# EAGLE design guest room controller (EAGLE 7.2.0)
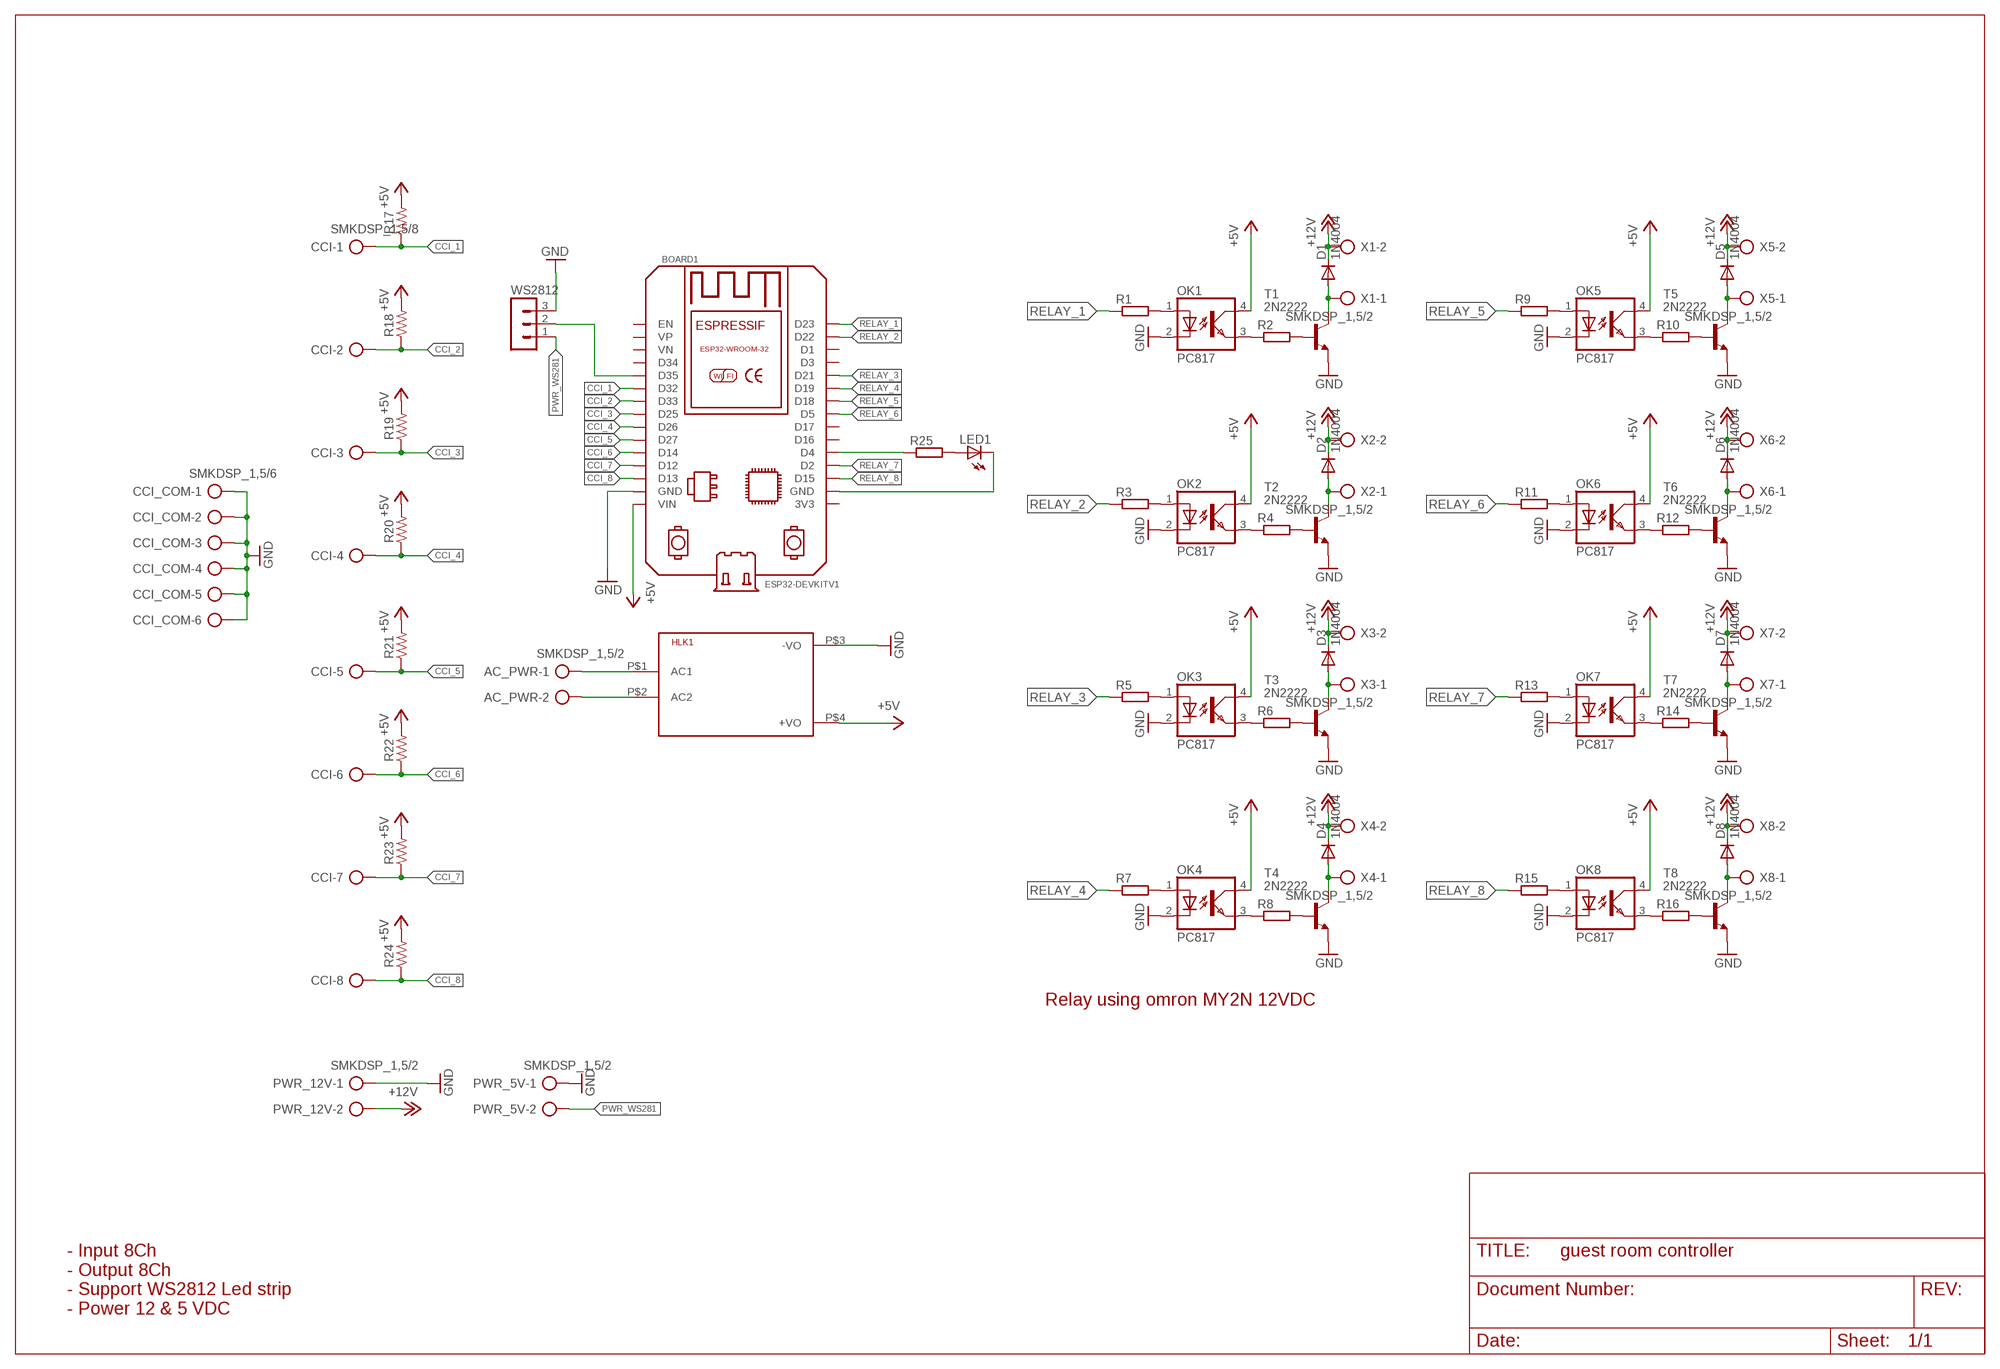
[diagram p0: schematic, sheet 1]

## Parts
AC_PWR  SMKDSP_1,5/2  [SMKDSP_1,5/2]
BOARD1  ESP32DEVKITV1  [ESP32-DEVKITV1]
CCI  SMKDSP_1,5/8  [SMKDSP_1,5/8]
CCI_COM  SMKDSP_1,5/6  [SMKDSP_1,5/6]
D1  1N4004  [DO41-10]
D2  1N4004  [DO41-10]
D3  1N4004  [DO41-10]
D4  1N4004  [DO41-10]
D5  1N4004  [DO41-10]
D6  1N4004  [DO41-10]
D7  1N4004  [DO41-10]
D8  1N4004  [DO41-10]
HLK1  HLK-PM013W  [HLK-PM01]
LED1  LED3MM  [LED3MM]
OK1  PC817  [DIL04]
OK2  PC817  [DIL04]
OK3  PC817  [DIL04]
OK4  PC817  [DIL04]
OK5  PC817  [DIL04]
OK6  PC817  [DIL04]
OK7  PC817  [DIL04]
OK8  PC817  [DIL04]
PWR_5V  SMKDSP_1,5/2  [SMKDSP_1,5/2]
PWR_12V  SMKDSP_1,5/2  [SMKDSP_1,5/2]
R1  R-EU_0207/10  [0207/10]
R2  R-EU_0207/10  [0207/10]
R3  R-EU_0207/10  [0207/10]
R4  R-EU_0207/10  [0207/10]
R5  R-EU_0207/10  [0207/10]
R6  R-EU_0207/10  [0207/10]
R7  R-EU_0207/10  [0207/10]
R8  R-EU_0207/10  [0207/10]
R9  R-EU_0207/10  [0207/10]
R10  R-EU_0207/10  [0207/10]
R11  R-EU_0207/10  [0207/10]
R12  R-EU_0207/10  [0207/10]
R13  R-EU_0207/10  [0207/10]
R14  R-EU_0207/10  [0207/10]
R15  R-EU_0207/10  [0207/10]
R16  R-EU_0207/10  [0207/10]
R17  R_1206  [R1206]
R18  R_1206  [R1206]
R19  R_1206  [R1206]
R20  R_1206  [R1206]
R21  R_1206  [R1206]
R22  R_1206  [R1206]
R23  R_1206  [R1206]
R24  R_1206  [R1206]
R25  R-EU_0207/10  [0207/10]
T1  2N2222  [TO18]
T2  2N2222  [TO18]
T3  2N2222  [TO18]
T4  2N2222  [TO18]
T5  2N2222  [TO18]
T6  2N2222  [TO18]
T7  2N2222  [TO18]
T8  2N2222  [TO18]
WS2812  MA03-1  [MA03-1]
X1  SMKDSP_1,5/2  [SMKDSP_1,5/2]
X2  SMKDSP_1,5/2  [SMKDSP_1,5/2]
X3  SMKDSP_1,5/2  [SMKDSP_1,5/2]
X4  SMKDSP_1,5/2  [SMKDSP_1,5/2]
X5  SMKDSP_1,5/2  [SMKDSP_1,5/2]
X6  SMKDSP_1,5/2  [SMKDSP_1,5/2]
X7  SMKDSP_1,5/2  [SMKDSP_1,5/2]
X8  SMKDSP_1,5/2  [SMKDSP_1,5/2]

## Nets
+5V: BOARD1.VIN HLK1.P$4(+VO) OK1.4(COL) OK2.4(COL) OK3.4(COL) OK4.4(COL) OK5.4(COL) OK6.4(COL) OK7.4(COL) OK8.4(COL) R17.2 R18.2 R19.2 R20.2 R21.2 R22.2 R23.2 R24.2
+12V: D1.C D2.C D3.C D4.C D5.C D6.C D7.C D8.C PWR_12V.2 X1.2 X2.2 X3.2 X4.2 X5.2 X6.2 X7.2 X8.2
CCI_1: BOARD1.D32 CCI.1 R17.1
CCI_2: BOARD1.D33 CCI.2 R18.1
CCI_3: BOARD1.D25 CCI.3 R19.1
CCI_4: BOARD1.D26 CCI.4 R20.1
CCI_5: BOARD1.D27 CCI.5 R21.1
CCI_6: BOARD1.D14 CCI.6 R22.1
CCI_7: BOARD1.D12 CCI.7 R23.1
CCI_8: BOARD1.D13 CCI.8 R24.1
GND: BOARD1.GND CCI_COM.1 CCI_COM.2 CCI_COM.3 CCI_COM.4 CCI_COM.5 CCI_COM.6 HLK1.P$3(-VO) OK1.2(C) OK2.2(C) OK3.2(C) OK4.2(C) OK5.2(C) OK6.2(C) OK7.2(C) OK8.2(C) PWR_5V.1 PWR_12V.1 T1.1(E) T2.1(E) T3.1(E) T4.1(E) T5.1(E) T6.1(E) T7.1(E) T8.1(E) WS2812.3
N$1: OK1.3(EMIT) R2.1
N$2: R2.2 T1.2(B)
N$3: D1.A T1.3(C) X1.1
N$4: OK2.3(EMIT) R4.1
N$5: R4.2 T2.2(B)
N$6: D2.A T2.3(C) X2.1
N$7: OK3.3(EMIT) R6.1
N$8: R6.2 T3.2(B)
N$9: D3.A T3.3(C) X3.1
N$10: OK4.3(EMIT) R8.1
N$11: R8.2 T4.2(B)
N$12: D4.A T4.3(C) X4.1
N$13: OK5.3(EMIT) R10.1
N$14: R10.2 T5.2(B)
N$15: D5.A T5.3(C) X5.1
N$16: OK6.3(EMIT) R12.1
N$17: R12.2 T6.2(B)
N$18: D6.A T6.3(C) X6.1
N$19: OK7.3(EMIT) R14.1
N$20: R14.2 T7.2(B)
N$21: D7.A T7.3(C) X7.1
N$22: OK8.3(EMIT) R16.1
N$23: R16.2 T8.2(B)
N$24: D8.A T8.3(C) X8.1
N$25: AC_PWR.1 HLK1.P$1(AC1)
N$26: OK1.1(A) R1.2
N$27: OK2.1(A) R3.2
N$28: OK3.1(A) R5.2
N$29: OK4.1(A) R7.2
N$30: OK5.1(A) R9.2
N$31: OK6.1(A) R11.2
N$32: OK7.1(A) R13.2
N$33: OK8.1(A) R15.2
N$35: BOARD1.D4 R25.1
N$36: LED1.A R25.2
N$37: BOARD1.GND@1(GND) LED1.K(C)
N$38: BOARD1.D35 WS2812.2
N$39: AC_PWR.2 HLK1.P$2(AC2)
PWR_WS281: PWR_5V.2 WS2812.1
RELAY_1: BOARD1.D23 R1.1
RELAY_2: BOARD1.D22 R3.1
RELAY_3: BOARD1.D21 R5.1
RELAY_4: BOARD1.D19 R7.1
RELAY_5: BOARD1.D18 R9.1
RELAY_6: BOARD1.D5 R11.1
RELAY_7: BOARD1.D2 R13.1
RELAY_8: BOARD1.D15 R15.1
Unconnected: BOARD1.3V3 BOARD1.D1 BOARD1.D3 BOARD1.D16 BOARD1.D17 BOARD1.D34 BOARD1.EN BOARD1.VN BOARD1.VP

## Notes on the sheet
- Relay using omron MY2N 12VDC
- - Input 8Ch
  - Output 8Ch
  - Support WS2812 Led strip
  - Power 12 & 5 VDC

## Library data of the parts
AC_PWR PWR_5V PWR_12V X1-X8 = con-phoenix-smkdsp:SMKDSP_1,5/2: Printklemme, Nennstrom: 17,5 A, Bemessungsspannung: 250 V, Raster: 5,0 mm Source: http://eshop.phoenixcontact.de .. 1733415.pdf; MF: FARNELL; MPN: 1733570; OC_FARNELL: 3041244; OC_NEWARK: 69C8588
BOARD1 = ESP32-DEVKITV1:ESP32DEVKITV1: https://github.com/shridattdudhat
CCI = con-phoenix-smkdsp:SMKDSP_1,5/8: Printklemme, Nennstrom: 17,5 A, Bemessungsspannung: 250 V, Raster: 5,0 mm Source: http://eshop.phoenixcontact.de .. 1733415.pdf; MF: FARNELL; MPN: 1733635; OC_FARNELL: 3041281; OC_NEWARK: 71C4133
CCI_COM = con-phoenix-smkdsp:SMKDSP_1,5/6: Printklemme, Nennstrom: 17,5 A, Bemessungsspannung: 250 V, Raster: 5,0 mm Source: http://eshop.phoenixcontact.de .. 1733415.pdf; MF: FARNELL; MPN: 1733619; OC_FARNELL: 3041270; OC_NEWARK: 71C4132
D1-D8 = diode:1N4004: DIODE general purpose rectifier, 1 A
HLK1 = HLK-PM01:HLK-PM01: Hi-Link Power Supply HLK-PM01 3W Author: Ahmed Said <https://github.com/AhmedSaid/EAGLELibraries>
LED1 = led:LED: LED OSRAM: - CHIPLED LG R971, LG N971, LY N971, LG Q971, LY Q971, LO R971, LY R971 LH N974, LH R974 LS Q976, LO Q976, LY Q976 LO Q996 - Hyper CHIPLED LW Q18S LB Q993, LB Q99A, LB R99A - SideLED LS A670, LO A670, LY A670, LG A670, LP A670 LB A673, LV A673, LT A673, LW A673 LH A674 LY A675 LS A676, LA A676, LO A676, LY A676, LW A676 LS A679, LY A679, LG A679 - Hyper Micro SIDELED® LS Y876, LA Y876, LO Y876, LY Y876 LT Y87S - SmartLED LW L88C, LW L88S LB L89C, LB L89S, LG L890 LS L89K, LO L89K, LY L89K LS L896, LA L896, LO L896, LY L896 - TOPLED LS T670, LO T670, LY T670, LG T670, LP T670 LSG T670, LSP T670, LSY T670, LOP T670, LYG T670 LG T671, LOG T671, LSG T671 LB T673, LV T673, LT T673, LW T673 LH T674 LS T676, LA T676, LO T676, LY T676, LB T676, LH T676, LSB T676, LW T676 LB T67C, LV T67C, LT T67C, LS T67K, LO T67K, LY T67K, LW E67C LS E67B, LA E67B, LO E67B, LY E67B, LB E67C, LV E67C, LT E67C LW T67C LS T679, LY T679, LG T679 LS T770, LO T770, LY T770, LG T770, LP T770 LB T773, LV T773, LT T773, LW T773 LH T774 LS E675, LA E675, LY E675, LS T675 LS T776, LA T776, LO T776, LY T776, LB T776 LHGB T686 LT T68C, LB T68C - Hyper Mini TOPLED® LB M676 - Mini TOPLED Santana® LG M470 LS M47K, LO M47K, LY M47K Source: http://www.osram.convergy.de LUXEON: - LUMILED® LXK2-PW12-R00, LXK2-PW12-S00, LXK2-PW14-U00, LXK2-PW14-V00 LXK2-PM12-R00, LXK2-PM12-S00, LXK2-PM14-U00 LXK2-PE12-Q00, LXK2-PE12-R00, LXK2-PE12-S00, LXK2-PE14-T00, LXK2-PE14-U00 LXK2-PB12-K00, LXK2-PB12-L00, LXK2-PB12-M00, LXK2-PB14-N00, LXK2-PB14-P00, LXK2-PB14-Q00 LXK2-PR12-L00, LXK2-PR12-M00, LXK2-PR14-Q00, LXK2-PR14-R00 LXK2-PD12-Q00, LXK2-PD12-R00, LXK2-PD12-S00 LXK2-PH12-R00, LXK2-PH12-S00 LXK2-PL12-P00, LXK2-PL12-Q00, LXK2-PL12-R00 Source: www.luxeon.com KINGBRIGHT: KA-3528ASYC Source: www.kingbright.com
OK1-OK8 = optocoupler:PC817: SHARP OPTO COUPLER; MPN: PC817X4J000F; OC_FARNELL: 9707727; OC_NEWARK: 97K7059
R1-R16 R25 = resistor:R-EU_: RESISTOR, European symbol
R17-R24 = rc-master-smd:R_: RESISTOR
T1-T8 = transistor:2N2222: NPN TRANSISTOR
WS2812 = con-lstb:MA03-1: PIN HEADER; OC_FARNELL: unknown; OC_NEWARK: unknown

## Board
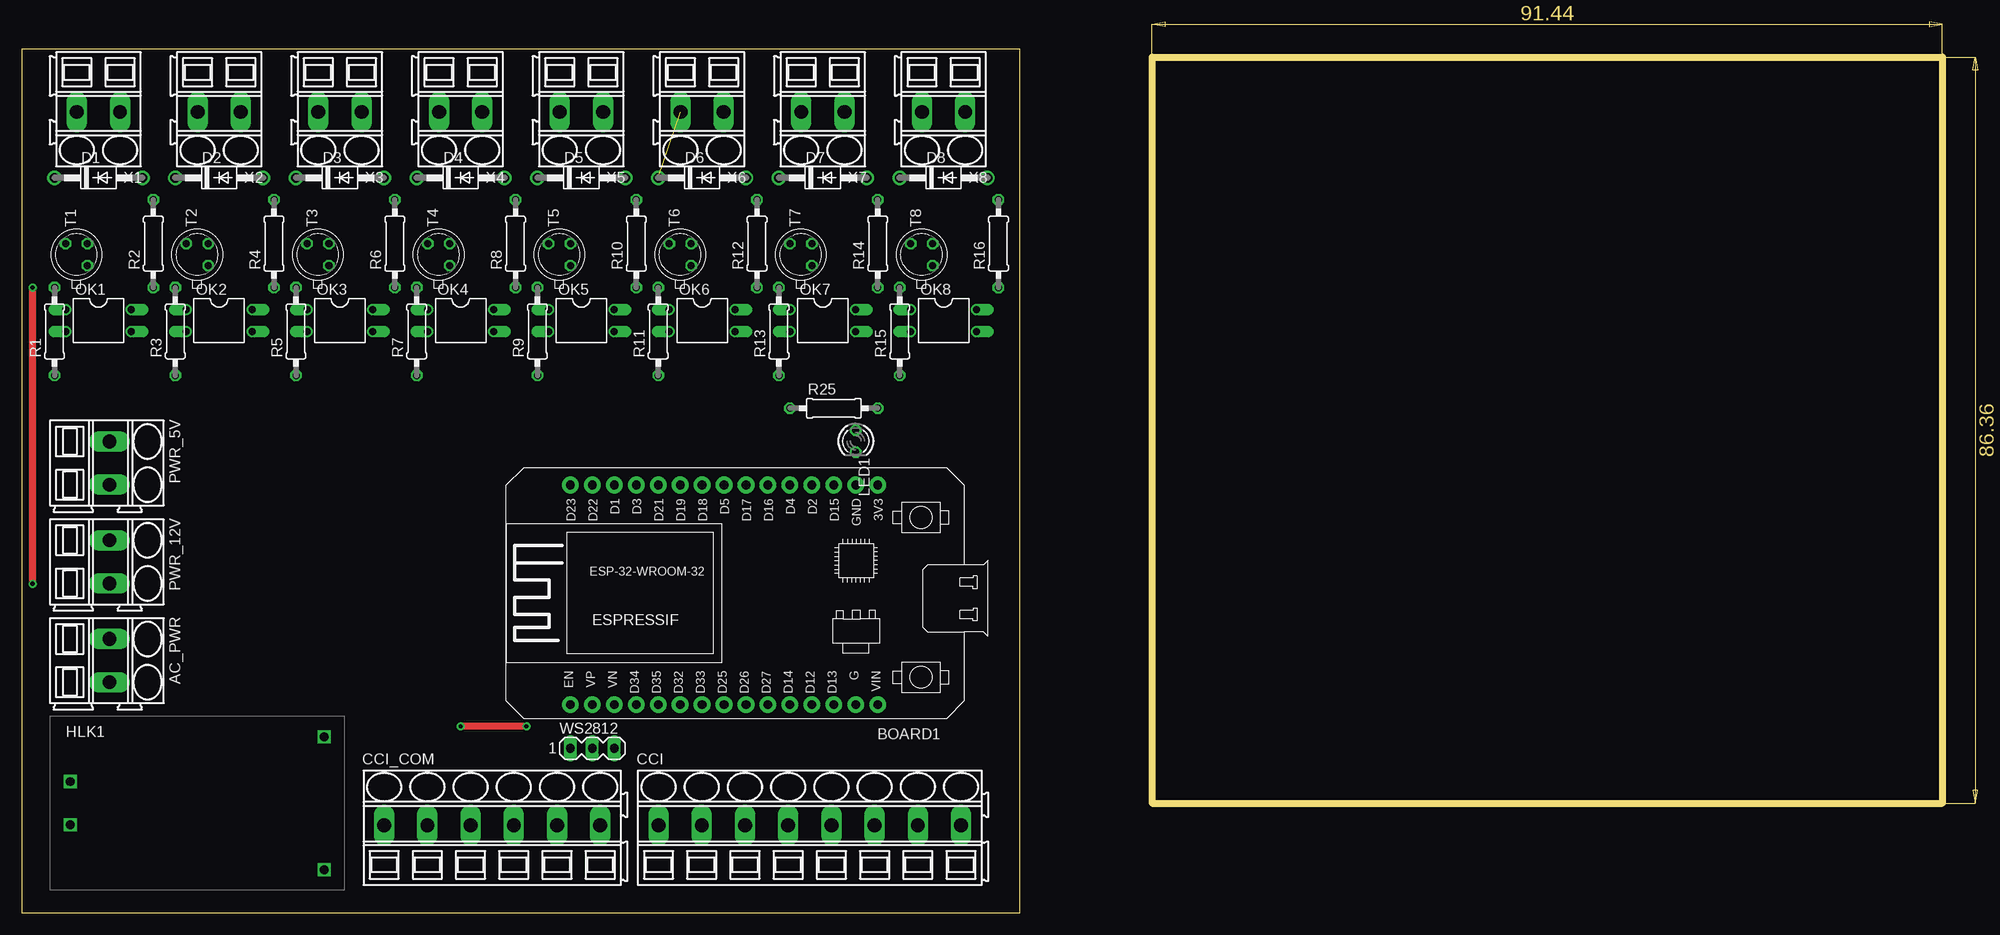
[diagram p1: board, top side]
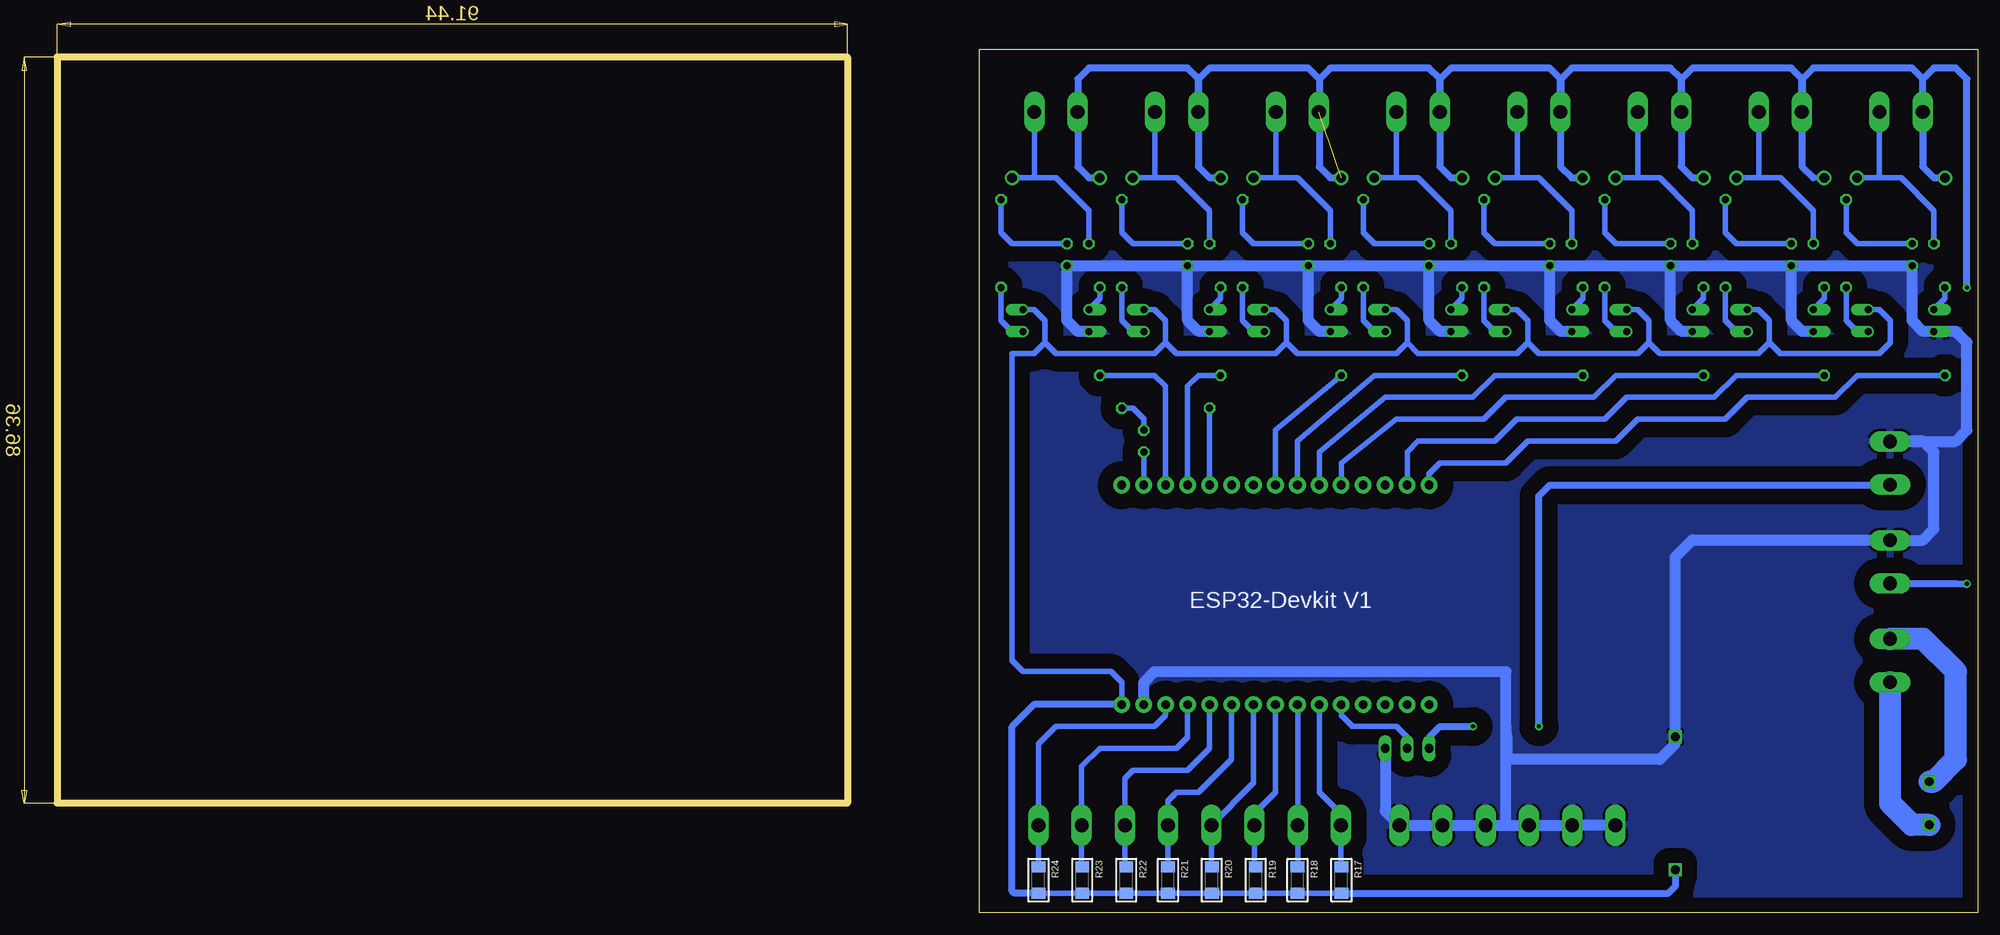
[diagram p2: board, bottom side, seen from below]

Size 222.25 x 100 mm. Coordinates in mm from the lower left corner, seen from the top.
Outline: 0,0 115.55,0 115.55,100 0,100 0,0
Outline: 130.81,99.06 222.25,99.06 222.25,12.7 130.81,12.7 130.81,99.06
Copper layers (1*16): Top 0.035mm / dielectric 1.5mm / Bottom 0.035mm
Design rules "default": minimum track width 10mil, minimum drill 24mil, track to track 8mil, track to pad 8mil, pad to pad 8mil, via to via 8mil, smd to smd 8mil, copper to edge 40mil, drill to drill 8mil, minimum pad ring 10mil, minimum via ring 8mil, stop-mask expansion 4mil, vias tented up to drill 0mil, thermal gap 10mil

### Footprints (pad centres in the part's own frame; a part is rotated, then mirrored left to right if it is on the bottom)
SMKDSP_1,5/2 = drill 1.6 pad 1.8 long: 1 -2.5,0; 2 2.5,0
ESP32-DEVKITV1 = drill 1 pad 1.93: 3V3 0,0; D1 30.48,0; D2 7.62,0; D3 27.94,0; D4 10.16,0; D5 17.78,0; D12 7.62,25.4; D13 5.08,25.4; D14 10.16,25.4; D15 5.08,0; D16 12.7,0; D17 15.24,0; D18 20.32,0; D19 22.86,0; D21 25.4,0; D22 33.02,0; D23 35.56,0; D25 17.78,25.4; D26 15.24,25.4; D27 12.7,25.4; D32 22.86,25.4; D33 20.32,25.4; D34 27.94,25.4; D35 25.4,25.4; EN 35.56,25.4; GND 2.54,25.4; GND@1 2.54,0; VIN 0,25.4; VN 30.48,25.4; VP 33.02,25.4
SMKDSP_1,5/8 = drill 1.6 pad 1.8 long: 1 -2.5,0; 2 2.5,0; 3 7.5,0; 4 12.5,0; 5 17.5,0; 6 22.5,0; 7 27.5,0; 8 32.5,0
SMKDSP_1,5/6 = drill 1.6 pad 1.8 long: 1 -2.5,0; 2 2.5,0; 3 7.5,0; 4 12.5,0; 5 17.5,0; 6 22.5,0
DO41-10 = drill 1.118: A 5.08,0; C -5.08,0
HLK-PM01 = drill 1.016 square: P$1 -14.7,2.5; P$2 -14.7,-2.5; P$3 14.7,7.7; P$4 14.7,-7.7
LED3MM = drill 0.813 octagon: A -1.27,0; K 1.27,0
DIL04 = drill 0.813 offset: 1 -1.27,-3.81; 2 1.27,-3.81; 3 1.27,3.81; 4 -1.27,3.81
0207/10 = drill 0.813 octagon: 1 -5.08,0; 2 5.08,0
R1206 = smd 1.3 x 1.6: 1 -1.524,0; 2 1.524,0
TO18 = drill 0.813 octagon: 1 -1.27,-1.27; 2 1.27,-1.27; 3 1.27,1.27
MA03-1 = drill 1.016 long: 1 -2.54,0; 2 0,0; 3 2.54,0

### Placement (x,y rotation side)
AC_PWR  10.16,29.21 270 top
BOARD1  99.06,49.53 180 top
CCI  76.2,10.16 0 top
CCI_COM  44.45,10.16 0 top
D1  8.89,85.09 0 top
D2  22.86,85.09 0 top
D3  36.83,85.09 0 top
D4  50.8,85.09 0 top
D5  64.77,85.09 0 top
D6  78.74,85.09 0 top
D7  92.71,85.09 0 top
D8  106.68,85.09 0 top
HLK1  20.32,12.7 0 top
LED1  96.52,54.61 270 top
OK1  8.89,68.58 270 top
OK2  22.86,68.58 270 top
OK3  36.83,68.58 270 top
OK4  50.8,68.58 270 top
OK5  64.77,68.58 270 top
OK6  78.74,68.58 270 top
OK7  92.71,68.58 270 top
OK8  106.68,68.58 270 top
PWR_5V  10.16,52.07 270 top
PWR_12V  10.16,40.64 270 top
R1  3.81,67.31 90 top
R2  15.24,77.47 90 top
R3  17.78,67.31 90 top
R4  29.21,77.47 90 top
R5  31.75,67.31 90 top
R6  43.18,77.47 90 top
R7  45.72,67.31 90 top
R8  57.15,77.47 90 top
R9  59.69,67.31 90 top
R10  71.12,77.47 90 top
R11  73.66,67.31 90 top
R12  85.09,77.47 90 top
R13  87.63,67.31 90 top
R14  99.06,77.47 90 top
R15  101.6,67.31 90 top
R16  113.03,77.47 90 top
R17  73.66,3.81 270 bottom
R18  78.74,3.81 270 bottom
R19  83.57,3.81 270 bottom
R20  88.65,3.81 270 bottom
R21  93.73,3.81 270 bottom
R22  98.55,3.81 270 bottom
R23  103.63,3.81 270 bottom
R24  108.71,3.81 270 bottom
R25  93.98,58.42 0 top
T1  6.35,76.2 90 top
T2  20.32,76.2 90 top
T3  34.29,76.2 90 top
T4  48.26,76.2 90 top
T5  62.23,76.2 90 top
T6  76.2,76.2 90 top
T7  90.17,76.2 90 top
T8  104.14,76.2 90 top
WS2812  66.04,19.05 0 top
X1  8.89,92.71 180 top
X2  22.86,92.71 180 top
X3  36.83,92.71 180 top
X4  50.8,92.71 180 top
X5  64.77,92.71 180 top
X6  78.74,92.71 180 top
X7  92.71,92.71 180 top
X8  106.68,92.71 180 top

### Tracks (layer width: path | path; a pad name or v marks a point on that pad's centre or on a via)
+5V
  Bottom 0.61: R24.2 R23.2 R22.2 R21.2 R20.2 R19.2 R18.2 R17.2 | OK8.4 109.22,69.85 107.95,68.58 107.95,66.04 | 107.95,66.04 106.68,64.77 95.25,64.77 93.98,66.04 | OK7.4 95.25,69.85 93.98,68.58 93.98,66.04 | 93.98,66.04 92.71,64.77 81.28,64.77 80.01,66.04 | OK6.4 81.28,69.85 80.01,68.58 80.01,66.04 | 80.01,66.04 78.74,64.77 67.31,64.77 66.04,66.04 | OK5.4 67.31,69.85 66.04,68.58 66.04,66.04 | 66.04,66.04 64.77,64.77 53.34,64.77 52.07,66.04 | 52.07,66.04 52.07,68.58 53.34,69.85 OK4.4 | OK3.4 39.37,69.85 38.1,68.58 38.1,66.04 | 38.1,66.04 39.37,64.77 50.8,64.77 52.07,66.04 | OK2.4 25.4,69.85 24.13,68.58 24.13,66.04 | 24.13,66.04 25.4,64.77 36.83,64.77 38.1,66.04 | OK1.4 11.43,69.85 10.16,68.58 10.16,66.04 11.43,64.77 22.86,64.77 24.13,66.04 | 107.95,66.04 109.22,64.77 111.76,64.77 111.76,29.21 110.49,27.94 100.33,27.94 99.06,26.67 BOARD1.VIN
  Bottom 0.813: BOARD1.VIN 109.22,24.13 111.76,21.59 111.76,2.54 111.51,2.29 R24.2 | R17.2 35.81,2.29 35.02,3.08 HLK1.P$4
+12V  (via drill 0.5)  (1 unrouted)
  Top 0.813: v1.27,38.1 v1.27,72.39
  Bottom 0.61: 19.05,85.09 D2.C
  Bottom 0.813: X2.2 20.36,86.4 19.05,85.09 | 6.39,96.52 X1.2 6.39,86.4 5.08,85.09 D1.C | 6.39,96.52 6.39,96.56 7.62,97.79 19.05,97.79 20.32,96.52 20.32,92.75 X2.2 | X2.2 20.36,96.56 21.59,97.79 33.02,97.79 34.29,96.52 34.29,92.75 X3.2 | X3.2 34.33,96.56 35.56,97.79 46.99,97.79 48.26,96.52 48.26,92.75 X4.2 | X4.2 48.3,96.56 49.53,97.79 60.96,97.79 62.23,96.52 62.23,92.75 X5.2 | X5.2 62.27,96.56 63.5,97.79 74.93,97.79 76.2,96.52 | 76.2,96.52 77.47,97.79 88.9,97.79 90.17,96.52 90.17,92.75 X7.2 | X7.2 90.21,96.56 91.44,97.79 102.87,97.79 104.14,96.52 104.14,92.71 | 104.14,92.71 X8.2 | 104.14,92.71 104.14,86.36 102.87,85.09 D8.C | X3.2 34.33,86.4 33.02,85.09 D3.C | X4.2 48.3,86.4 46.99,85.09 D4.C | X5.2 62.27,86.4 60.96,85.09 D5.C | 76.2,96.52 76.2,86.36 74.93,85.09 D6.C | X7.2 90.21,86.4 88.9,85.09 D7.C | PWR_12V.2 2.5,38.14 v1.27,38.1 | v1.27,72.39 1.27,96.52 2.54,97.79 5.12,97.79 6.39,96.52
CCI_1
  Bottom 0.61: BOARD1.D32 76.2,13.97 73.7,11.47 CCI.1 73.7,5.37 R17.1
CCI_2
  Bottom 0.61: BOARD1.D33 78.7,24.09 CCI.2 78.7,5.37 R18.1
CCI_3
  Bottom 0.61: BOARD1.D25 81.28,13.97 83.7,11.55 CCI.3 83.7,5.47 R19.1 83.82,5.08
CCI_4
  Bottom 0.61: BOARD1.D26 83.82,15.04 CCI.4 88.7,5.28 | 88.7,5.28 R20.1 88.7,5.28 | 88.7,5.28 88.9,5.08
CCI_5
  Bottom 0.61: BOARD1.D27 86.36,17.78 90.17,13.97 92.71,13.97 93.7,12.98 CCI.5 93.7,5.36 R21.1 93.98,5.08
CCI_6
  Bottom 0.61: BOARD1.D14 88.9,19.05 91.44,16.51 97.79,16.51 98.7,15.6 CCI.6 98.7,5.44 R22.1 99.06,5.08
CCI_7
  Bottom 0.61: BOARD1.D12 91.44,20.32 92.71,19.05 101.6,19.05 103.7,16.95 CCI.7 103.7,5.52 103.89,5.33 | R23.1 103.89,5.33 | 103.89,5.33 104.14,5.08
CCI_8
  Bottom 0.61: BOARD1.D13 93.98,22.86 95.25,21.59 106.68,21.59 108.7,19.57 CCI.8 108.7,5.35 R24.1 108.97,5.33 109.22,5.08
GND
  Bottom 1.27: 50.8,10.16 CCI_COM.3 | CCI_COM.3 CCI_COM.2 CCI_COM.1 | BOARD1.GND 96.52,26.67 95.25,27.94 54.61,27.94 54.61,21.59 | 54.61,10.16 CCI_COM.3 | T7.1 T8.1 105.41,68.58 104.14,67.31 OK8.2 | T7.1 T6.1 | T6.1 T5.1 | T5.1 T4.1 | T4.1 T3.1 | T3.1 T2.1 | T2.1 T1.1 7.62,68.58 6.35,67.31 OK1.2 2.54,67.31 1.27,66.04 1.27,55.88 2.58,54.57 PWR_5V.1 10.12,54.61 6.35,54.61 5.08,53.34 5.08,44.45 6.39,43.14 PWR_12V.1 10.2,43.18 33.02,43.18 35.02,41.18 HLK1.P$3 35.02,19.59 36.83,17.78 54.61,17.78 | OK7.2 90.17,67.31 91.44,68.58 T7.1 | OK6.2 76.2,67.31 77.47,68.58 T6.1 | OK5.2 62.23,67.31 63.5,68.58 T5.1 | OK4.2 48.26,67.31 49.53,68.58 T4.1 | OK3.2 34.29,67.31 35.56,68.58 T3.1 | OK2.2 20.32,67.31 21.59,68.58 T2.1 | 54.61,10.16 CCI_COM.4 CCI_COM.5 CCI_COM.6 68.58,11.79 WS2812.3 | 54.61,10.16 54.61,17.78 | 54.61,17.78 54.61,19.05 | 54.61,19.05 54.61,21.59 | 54.53,20.4 54.61,19.05 | 54.53,20.4 54.61,21.59 | 54.53,20.4 54.53,17.86 54.61,17.78
  pour Bottom (isolate 1.778): 1.27,99.06 114.3,99.06 114.3,1.27 1.27,1.27
N$1
  Bottom 0.61: R2.1 15.24,68.58 13.97,67.31 OK1.3
N$2
  Bottom 0.61: T1.2 13.97,77.47 15.24,78.74 R2.2
N$3
  Bottom 0.61: T1.3 5.08,81.28 8.89,85.09 11.43,85.09 | 11.43,85.09 D1.A | X1.1 11.39,85.13 11.43,85.09
N$4
  Bottom 0.61: R4.1 29.21,68.58 27.94,67.31 OK2.3
N$5
  Bottom 0.61: T2.2 27.94,77.47 29.21,78.74 R4.2
N$6
  Bottom 0.61: T2.3 19.05,81.28 22.86,85.09 25.4,85.09 | 25.4,85.09 D2.A | X2.1 25.36,85.13 25.4,85.09
N$7
  Bottom 0.61: R6.1 43.18,68.58 41.91,67.31 OK3.3
N$8
  Bottom 0.61: T3.2 41.91,77.47 43.18,78.74 R6.2
N$9
  Bottom 0.61: T3.3 33.02,81.28 36.83,85.09 39.37,85.09 | 39.37,85.09 D3.A | X3.1 39.33,85.13 39.37,85.09
N$10
  Bottom 0.61: R8.1 57.15,68.58 55.88,67.31 OK4.3
N$11
  Bottom 0.61: T4.2 55.88,77.47 57.15,78.74 R8.2
N$12
  Bottom 0.61: T4.3 46.99,81.28 50.8,85.09 53.34,85.09 | 53.34,85.09 D4.A | X4.1 53.3,85.13 53.34,85.09
N$13
  Bottom 0.61: R10.1 71.12,68.58 69.85,67.31 OK5.3
N$14
  Bottom 0.61: T5.2 69.85,77.47 71.12,78.74 R10.2
N$15
  Bottom 0.61: T5.3 60.96,81.28 64.77,85.09 67.31,85.09 | 67.31,85.09 D5.A | X5.1 67.27,85.13 67.31,85.09
N$16
  Bottom 0.61: R12.1 85.09,68.58 83.82,67.31 OK6.3
N$17
  Bottom 0.61: T6.2 83.82,77.47 85.09,78.74 R12.2
N$18
  Bottom 0.61: T6.3 74.93,81.28 78.74,85.09 81.28,85.09 | 81.28,85.09 D6.A | X6.1 81.24,85.13 81.28,85.09
N$19
  Bottom 0.61: R14.1 99.06,68.58 97.79,67.31 OK7.3
N$20
  Bottom 0.61: T7.2 97.79,77.47 99.06,78.74 R14.2
N$21
  Bottom 0.61: T7.3 88.9,81.28 92.71,85.09 95.25,85.09 | 95.25,85.09 D7.A | X7.1 95.21,85.13 95.25,85.09
N$22
  Bottom 0.61: R16.1 113.03,68.58 111.76,67.31 OK8.3
N$23
  Bottom 0.61: T8.2 111.76,77.47 113.03,78.74 R16.2
N$24
  Bottom 0.61: X8.1 109.18,85.13 109.22,85.09 | 110.49,85.09 D8.A 109.22,85.09 | T8.3 102.87,81.28 106.68,85.09 109.22,85.09
N$25
  Bottom 2.54: HLK1.P$1 5.12,15.2 2.54,17.78 2.54,27.94 6.35,31.75 10.12,31.75 AC_PWR.1
N$26
  Bottom 0.61: R1.2 3.81,71.12 OK1.1
N$27
  Bottom 0.61: R3.2 17.78,71.12 OK2.1
N$28
  Bottom 0.61: R5.2 31.75,71.12 OK3.1
N$29
  Bottom 0.61: R7.2 45.72,71.12 OK4.1
N$30
  Bottom 0.61: R9.2 59.69,71.12 OK5.1
N$31
  Bottom 0.61: R11.2 73.66,71.12 OK6.1
N$32
  Bottom 0.61: R13.2 87.63,71.12 OK7.1
N$33
  Bottom 0.61: R15.2 101.6,71.12 OK8.1
N$35
  Bottom 0.61: BOARD1.D4 R25.1
N$36
  Bottom 0.61: R25.2 97.79,58.42 96.52,57.15 LED1.A
N$37
  Bottom 0.61: LED1.K BOARD1.GND@1
N$38
  Bottom 0.61: WS2812.2 66.04,20.32 67.31,21.59 72.39,21.59 73.66,22.86 BOARD1.D35
N$39
  Bottom 2.54: HLK1.P$2 7.66,10.2 10.16,12.7 AC_PWR.2
PWR_WS281  (via drill 0.5)
  Top 0.813: v58.42,21.59 v50.8,21.59
  Bottom 0.813: WS2812.1 63.5,20.32 62.23,21.59 v58.42,21.59 | v50.8,21.59 50.8,48.26 49.53,49.53 10.2,49.53 PWR_5V.2
RELAY_1
  Bottom 0.61: BOARD1.D23 63.5,50.8 62.23,52.07 54.61,52.07 52.07,54.61 41.91,54.61 39.37,57.15 29.21,57.15 26.67,59.69 16.51,59.69 13.97,62.23 R1.1
RELAY_2
  Bottom 0.61: BOARD1.D22 66.04,53.34 64.77,54.61 55.88,54.61 53.34,57.15 43.18,57.15 40.64,59.69 30.48,59.69 27.94,62.23 R3.1
RELAY_3
  Bottom 0.61: BOARD1.D21 73.66,52.07 67.31,57.15 57.15,57.15 54.61,59.69 44.45,59.69 41.91,62.23 R5.1
RELAY_4
  Bottom 0.61: BOARD1.D19 76.2,53.34 68.58,59.69 58.42,59.69 55.88,62.23 R7.1
RELAY_5
  Bottom 0.61: BOARD1.D18 78.74,54.61 69.85,62.23 R9.1
RELAY_6
  Bottom 0.61: R11.1 81.28,55.88 BOARD1.D5
RELAY_7
  Bottom 0.61: R13.1 90.17,62.23 91.44,60.96 BOARD1.D2
RELAY_8
  Bottom 0.61: R15.1 95.25,62.23 93.98,60.96 BOARD1.D15